# Altium schematic sheet Connectors.SchDoc
size A; SheetNumber: 3; SheetTotal: 4
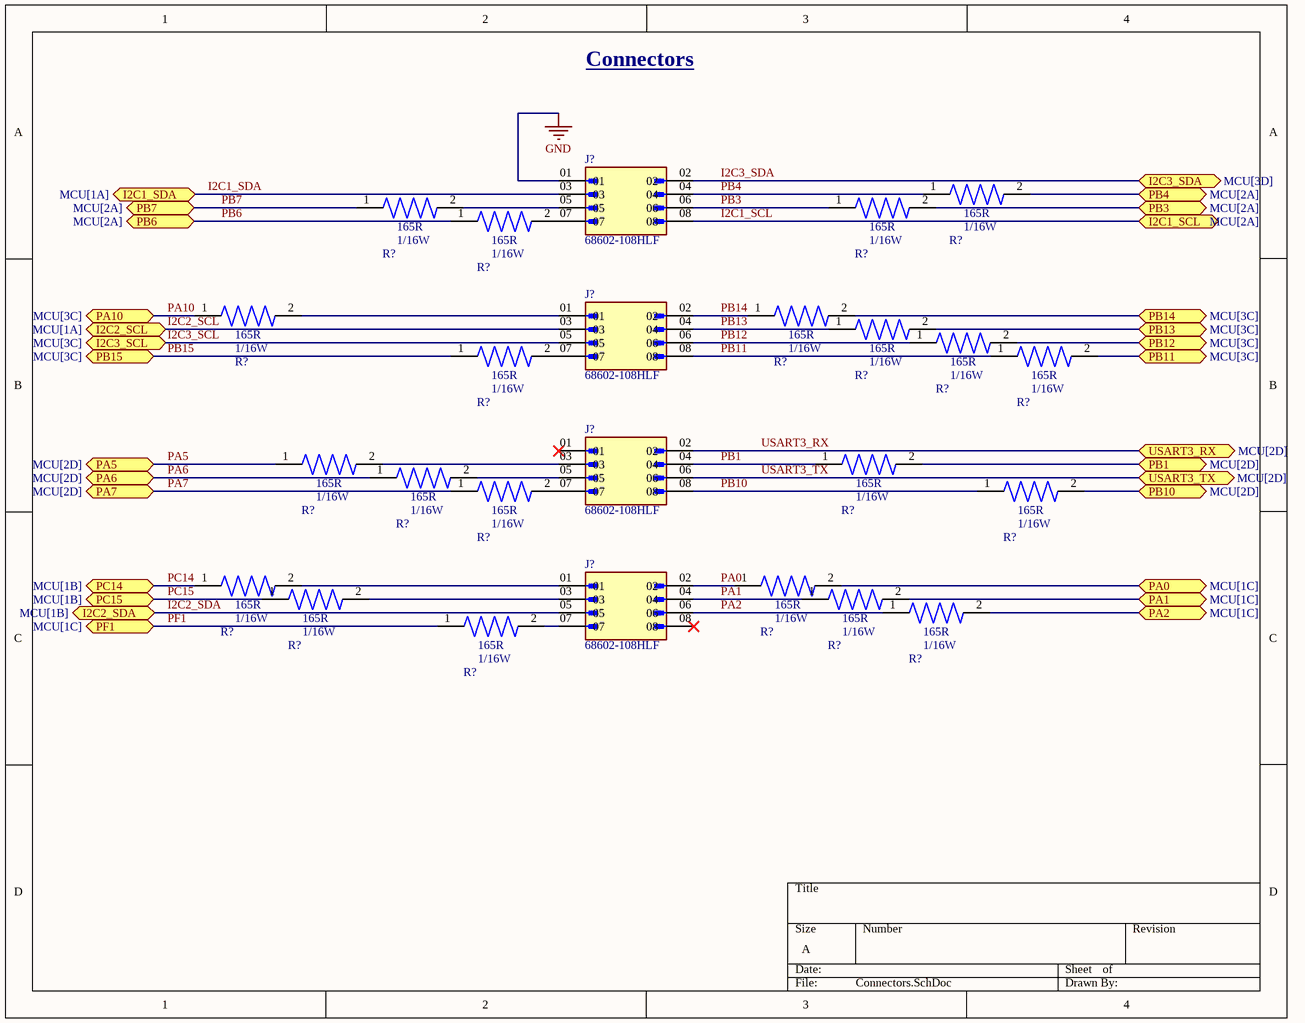
[diagram p0: Connectors.SchDoc]

## Parts
(Parts that share a designator on the sheet are numbered #1, #2 ... from top to bottom, then left to right.)
J?#1  68602-108HLF  [AMPHENOL_68602-108HLF]
J?#2  68602-108HLF  [AMPHENOL_68602-108HLF]
J?#3  68602-108HLF  [AMPHENOL_68602-108HLF]
J?#4  68602-108HLF  [AMPHENOL_68602-108HLF]
R?#1  RC0402FR-07165RL  [RESC1005X40N]  (value not drawn)
R?#2  RC0402FR-07165RL  [RESC1005X40N]  (value not drawn)
R?#3  RC0402FR-07165RL  [RESC1005X40N]  (value not drawn)
R?#4  RC0402FR-07165RL  [RESC1005X40N]  (value not drawn)
R?#5  RC0402FR-07165RL  [RESC1005X40N]  (value not drawn)
R?#6  RC0402FR-07165RL  [RESC1005X40N]  (value not drawn)
R?#7  RC0402FR-07165RL  [RESC1005X40N]  (value not drawn)
R?#8  RC0402FR-07165RL  [RESC1005X40N]  (value not drawn)
R?#9  RC0402FR-07165RL  [RESC1005X40N]  (value not drawn)
R?#10  RC0402FR-07165RL  [RESC1005X40N]  (value not drawn)
R?#11  RC0402FR-07165RL  [RESC1005X40N]  (value not drawn)
R?#12  RC0402FR-07165RL  [RESC1005X40N]  (value not drawn)
R?#13  RC0402FR-07165RL  [RESC1005X40N]  (value not drawn)
R?#14  RC0402FR-07165RL  [RESC1005X40N]  (value not drawn)
R?#15  RC0402FR-07165RL  [RESC1005X40N]  (value not drawn)
R?#16  RC0402FR-07165RL  [RESC1005X40N]  (value not drawn)
R?#17  RC0402FR-07165RL  [RESC1005X40N]  (value not drawn)
R?#18  RC0402FR-07165RL  [RESC1005X40N]  (value not drawn)
R?#19  RC0402FR-07165RL  [RESC1005X40N]  (value not drawn)
R?#20  RC0402FR-07165RL  [RESC1005X40N]  (value not drawn)
R?#21  RC0402FR-07165RL  [RESC1005X40N]  (value not drawn)

## Ports
I2C1_SCL (bidir, see MCU[2A]), I2C1_SDA (bidir, see MCU[1A]), I2C2_SCL (bidir, see MCU[1A]), I2C2_SDA (bidir, see MCU[1B]), I2C3_SCL (bidir, see MCU[3C]), I2C3_SDA (bidir, see MCU[3D]), PA0 (bidir, see MCU[1C]), PA1 (bidir, see MCU[1C]), PA2 (bidir, see MCU[1C]), PA5 (bidir, see MCU[2D]), PA6 (bidir, see MCU[2D]), PA7 (bidir, see MCU[2D]), PA10 (bidir, see MCU[3C]), PB1 (bidir, see MCU[2D]), PB3 (bidir, see MCU[2A]), PB4 (bidir, see MCU[2A]), PB6 (bidir, see MCU[2A]), PB7 (bidir, see MCU[2A]), PB10 (bidir, see MCU[2D]), PB11 (bidir, see MCU[3C]), PB12 (bidir, see MCU[3C]), PB13 (bidir, see MCU[3C]), PB14 (bidir, see MCU[3C]), PB15 (bidir, see MCU[3C]), PC14 (bidir, see MCU[1B]), PC15 (bidir, see MCU[1B]), PF1 (bidir, see MCU[1C]), USART3_RX (bidir, see MCU[2D]), USART3_TX (bidir, see MCU[2D])

## Nets
GND: J?#1.01
I2C1_SCL: J?#1.08 ; port I2C1_SCL
I2C1_SDA: J?#1.03 ; port I2C1_SDA
I2C2_SCL: J?#2.03 ; port I2C2_SCL
I2C2_SDA: J?#4.05 ; port I2C2_SDA
I2C3_SCL: J?#2.05 ; port I2C3_SCL
I2C3_SDA: J?#1.02 ; port I2C3_SDA
PA0: J?#4.02 R?#17.1
PA0: R?#17.2 ; port PA0  [a separate net that carries the same name]
PA1: J?#4.04 R?#19.1
PA1: R?#19.2 ; port PA1  [a separate net that carries the same name]
PA2: J?#4.06 R?#20.1
PA2: R?#20.2 ; port PA2  [a separate net that carries the same name]
PA5: R?#11.1 ; port PA5
PA6: R?#13.1 ; port PA6
PA7: R?#14.1 ; port PA7
PA10: R?#5.1 ; port PA10
PB1: J?#3.04 R?#12.1
PB1: R?#12.2 ; port PB1  [a separate net that carries the same name]
PB3: J?#1.06 R?#3.1
PB3: R?#3.2 ; port PB3  [a separate net that carries the same name]
PB4: J?#1.04 R?#1.1
PB4: R?#1.2 ; port PB4  [a separate net that carries the same name]
PB6: R?#4.1 ; port PB6
PB7: R?#2.1 ; port PB7
PB10: J?#3.08 R?#15.1
PB10: R?#15.2 ; port PB10  [a separate net that carries the same name]
PB11: J?#2.08 R?#10.1
PB11: R?#10.2 ; port PB11  [a separate net that carries the same name]
PB12: J?#2.06 R?#8.1
PB12: R?#8.2 ; port PB12  [a separate net that carries the same name]
PB13: J?#2.04 R?#7.1
PB13: R?#7.2 ; port PB13  [a separate net that carries the same name]
PB14: J?#2.02 R?#6.1
PB14: R?#6.2 ; port PB14  [a separate net that carries the same name]
PB15: R?#9.1 ; port PB15
PC14: R?#16.1 ; port PC14
PC15: R?#18.1 ; port PC15
PF1: R?#21.1 ; port PF1
USART3_RX: J?#3.02 ; port USART3_RX
USART3_TX: J?#3.06 ; port USART3_TX
NetJ?#1_05: J?#1.05 R?#2.2
NetJ?#1_07: J?#1.07 R?#4.2
NetJ?#2_01: J?#2.01 R?#5.2
NetJ?#2_07: J?#2.07 R?#9.2
NetJ?#3_03: J?#3.03 R?#11.2
NetJ?#3_05: J?#3.05 R?#13.2
NetJ?#3_07: J?#3.07 R?#14.2
NetJ?#4_01: J?#4.01 R?#16.2
NetJ?#4_03: J?#4.03 R?#18.2
NetJ?#4_07: J?#4.07 R?#21.2

Not connected (* = marked no-connect by the designer): J?#3 01*; J?#4 08*

## Notes on the sheet
- Connectors
- (in symbol RES-165-0001) 165R; 1/16W

## Library data of the parts
J?#1-J?#4 = CONN-8POS-0002: CONN HEADER VERT 8POS 2.54MM; MF: Amphenol ICC (FCI); SnapEDA_Link: https://www.snapeda.com/parts/68602-108HLF/Amphenol+FCI/view-part/?ref=snap; Package: None; MP: 68602-108HLF; Check_prices: https://www.snapeda.com/parts/68602-108HLF/Amphenol+FCI/view-part/?ref=eda; Price: None; Value: *; Availability: In Stock
R?#1-R?#21 = RES-165-0001: RES 165 OHM 1% 1/16W 0402; Package: None; Price: None; Value: *; MP: RC0402FR-07165RL; Availability: Unavailable